# Altium schematic sheet sensores.SchDoc
size A4
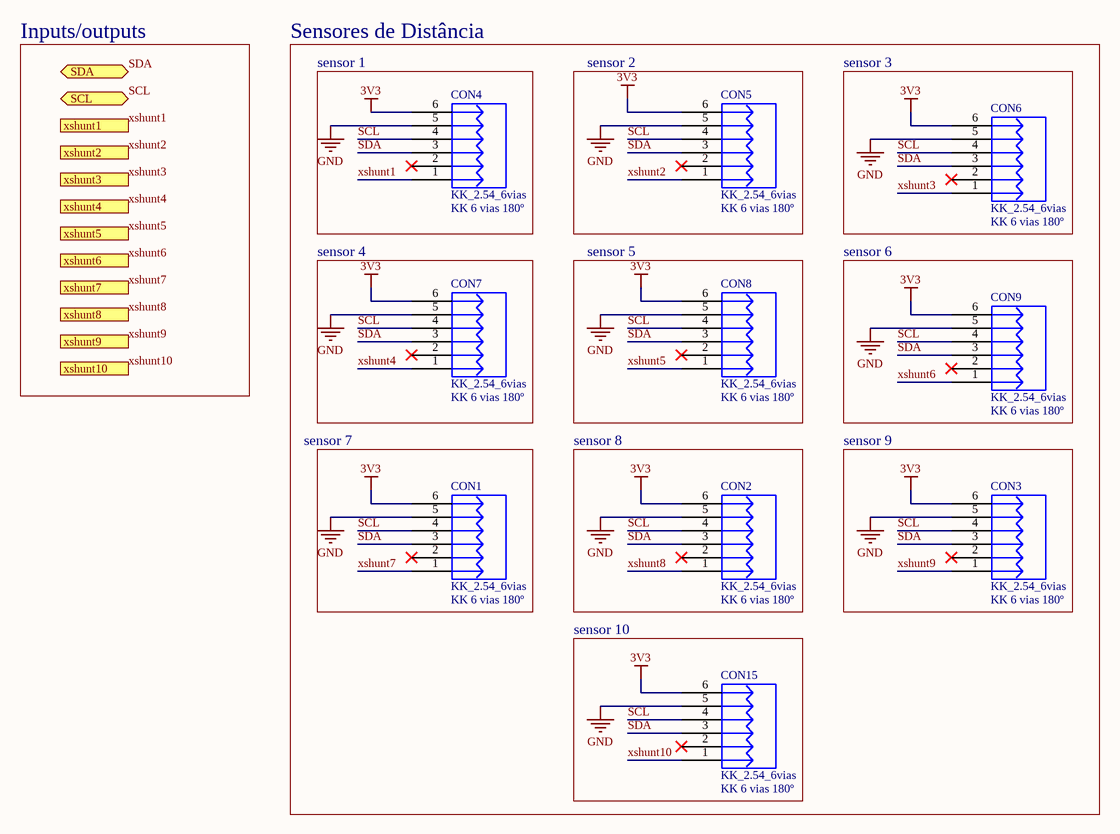
[diagram p0: sensores.SchDoc]

## Parts
CON1  KK_2.54_6vias  Valor: KK 6 vias 180º  [KK_6vias_180°]
CON2  KK_2.54_6vias  Valor: KK 6 vias 180º  [KK_6vias_180°]
CON3  KK_2.54_6vias  Valor: KK 6 vias 180º  [KK_6vias_180°]
CON4  KK_2.54_6vias  Valor: KK 6 vias 180º  [KK_6vias_180°]
CON5  KK_2.54_6vias  Valor: KK 6 vias 180º  [KK_6vias_180°]
CON6  KK_2.54_6vias  Valor: KK 6 vias 180º  [KK_6vias_180°]
CON7  KK_2.54_6vias  Valor: KK 6 vias 180º  [KK_6vias_180°]
CON8  KK_2.54_6vias  Valor: KK 6 vias 180º  [KK_6vias_180°]
CON9  KK_2.54_6vias  Valor: KK 6 vias 180º  [KK_6vias_180°]
CON15  KK_2.54_6vias  Valor: KK 6 vias 180º  [KK_6vias_180°]

## Blocks framed on the sheet
Sensores de Distância: CON1
sensor 1: CON4
sensor 2: CON5
sensor 3: CON6
sensor 4: CON7
sensor 5: CON8
sensor 6: CON9
sensor 8: CON2
sensor 9: CON3
sensor 10: CON15

## Ports
SCL (bidir), SDA (bidir), xshunt1 (in), xshunt2 (in), xshunt3 (in), xshunt4 (in), xshunt5 (in), xshunt6 (in), xshunt7 (in), xshunt8 (in), xshunt9 (in), xshunt10 (in)

## Nets
3V3: CON1.6 CON2.6 CON3.6 CON4.6 CON5.6 CON6.6 CON7.6 CON8.6 CON9.6 CON15.6
GND: CON1.5 CON2.5 CON3.5 CON4.5 CON5.5 CON6.5 CON7.5 CON8.5 CON9.5 CON15.5
SCL: CON1.4 CON2.4 CON3.4 CON4.4 CON5.4 CON6.4 CON7.4 CON8.4 CON9.4 CON15.4 ; port SCL
SDA: CON1.3 CON2.3 CON3.3 CON4.3 CON5.3 CON6.3 CON7.3 CON8.3 CON9.3 CON15.3 ; port SDA
xshunt1: CON4.1 ; port xshunt1
xshunt2: CON5.1 ; port xshunt2
xshunt3: CON6.1 ; port xshunt3
xshunt4: CON7.1 ; port xshunt4
xshunt5: CON8.1 ; port xshunt5
xshunt6: CON9.1 ; port xshunt6
xshunt7: CON1.1 ; port xshunt7
xshunt8: CON2.1 ; port xshunt8
xshunt9: CON3.1 ; port xshunt9
xshunt10: CON15.1 ; port xshunt10

Not connected (* = marked no-connect by the designer): CON1 2*; CON2 2*; CON3 2*; CON4 2*; CON5 2*; CON6 2*; CON7 2*; CON8 2*; CON9 2*; CON15 2*

## Notes on the sheet
- Inputs/outputs
- sensor 7

## Library data of the parts
CON1-CON9 CON15 = KK_2.54_6vias: Conector KK 2.54mm 6 vias; Descrição: Conector KK 3 vias com passo 2.54mm; Encapsulamento: PTH - 180º; Modelo: 3 vias - 180º; Marca: *; Observação: *